# Altium schematic sheet 陀螺仪.SchDoc
size A4
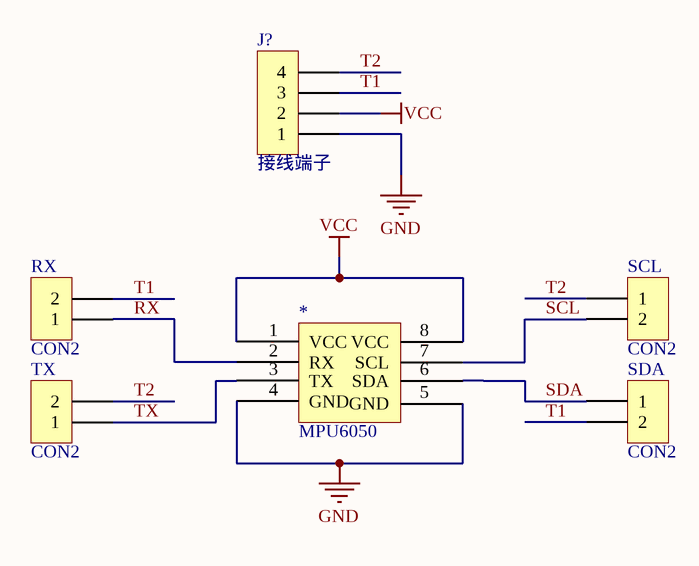
[diagram p0: 陀螺仪.SchDoc]

## Parts
*  MPU6050
J?  接线端子  [SIP4]
RX  CON2  [SIP2]
SCL  CON2  [SIP2]
SDA  CON2  [SIP2]
TX  CON2  [SIP2]

## Nets
GND: *.4(GND) *.5(GND) J?.1
VCC: *.1(VCC) *.8(VCC) J?.2
RX: *.2(RX) RX.1
SCL: *.7(SCL) SCL.2
SDA: *.6(SDA) SDA.1
T1: J?.3 RX.2 SDA.2
T2: J?.4 SCL.1 TX.2
TX: *.3(TX) TX.1

## Library data of the parts
J? = CON4: Connector
RX SCL SDA TX = CON2: Connector